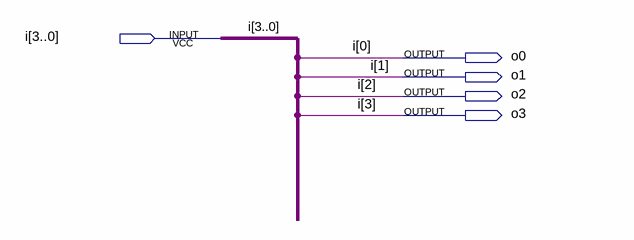
[diagram p0: schematic sheet]
// Quartus schematic t4but_to_4line.bdf as structural Verilog: 0 symbols, 5 pins
module t4but_to_4line (
  input  [3:0] i,
  output o0,
  output o1,
  output o2,
  output o3
);


  assign o0 = i[0];
  assign o1 = i[1];
  assign o2 = i[2];
  assign o3 = i[3];
endmodule
